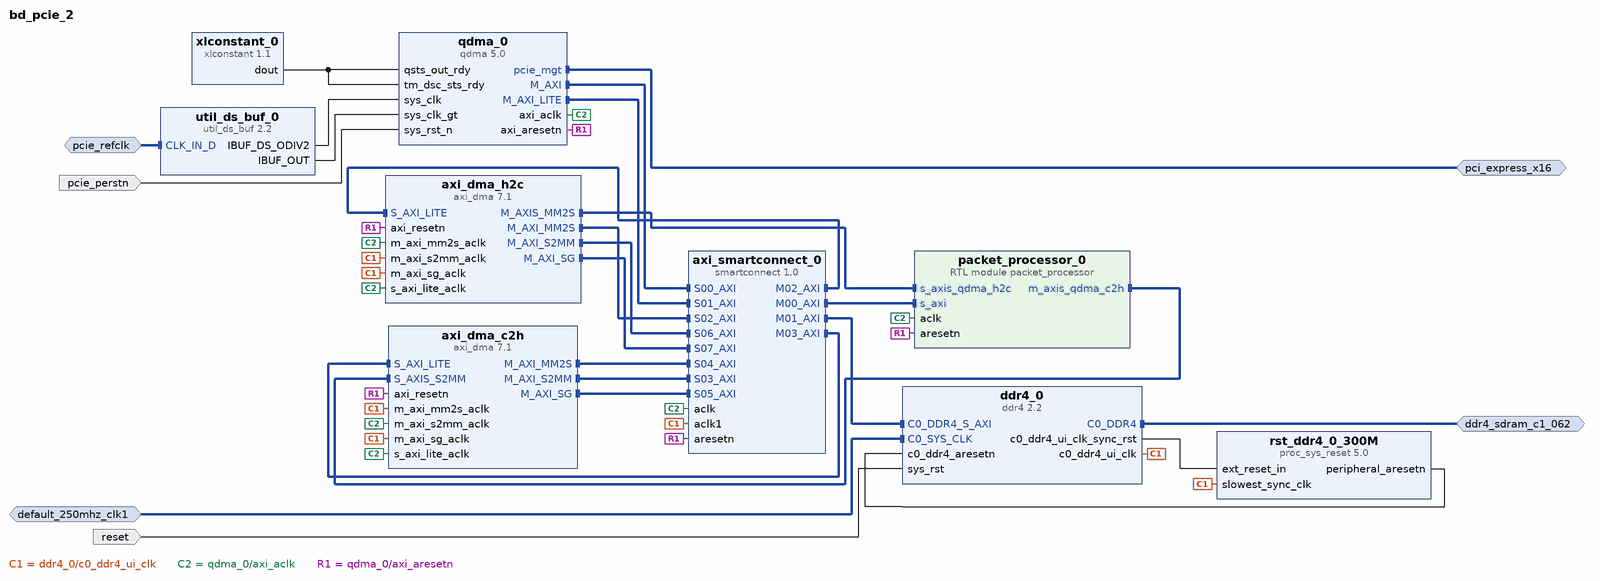
[diagram p0: block diagram of the top level]
# Vivado block design bd_pcie_2, xcvu9p-flga2104-2L-e, Vivado 2023.2
create_bd_design bd_pcie_2

create_bd_intf_port -mode Master -vlnv xilinx.com:interface:pcie_7x_mgt_rtl:1.0 pci_express_x16
create_bd_intf_port -mode Slave -vlnv xilinx.com:interface:diff_clock_rtl:1.0 pcie_refclk
set_property -dict {CONFIG.FREQ_HZ 100000000} [get_bd_intf_ports pcie_refclk]
create_bd_intf_port -mode Master -vlnv xilinx.com:interface:ddr4_rtl:1.0 ddr4_sdram_c1_062
create_bd_intf_port -mode Slave -vlnv xilinx.com:interface:diff_clock_rtl:1.0 default_250mhz_clk1
set_property -dict {CONFIG.FREQ_HZ 250000000} [get_bd_intf_ports default_250mhz_clk1]
create_bd_port -dir I -type rst pcie_perstn
set_property -dict {CONFIG.POLARITY ACTIVE_LOW} [get_bd_ports pcie_perstn]
create_bd_port -dir I -type rst reset
set_property -dict {CONFIG.POLARITY ACTIVE_HIGH} [get_bd_ports reset]

create_bd_cell -type ip -vlnv xilinx.com:ip:qdma:5.0 qdma_0
set_property -dict [list \
  CONFIG.MAILBOX_ENABLE true \
  CONFIG.PCIE_BOARD_INTERFACE pci_express_x16 \
  CONFIG.SYS_RST_N_BOARD_INTERFACE pcie_perstn \
  CONFIG.dma_intf_sel_qdma AXI_MM \
  CONFIG.mode_selection Basic \
  CONFIG.pf0_bar2_enabled_qdma true \
] [get_bd_cells qdma_0]
create_bd_cell -type ip -vlnv xilinx.com:ip:xlconstant:1.1 xlconstant_0
create_bd_cell -type ip -vlnv xilinx.com:ip:util_ds_buf:2.2 util_ds_buf_0
set_property -dict {CONFIG.DIFF_CLK_IN_BOARD_INTERFACE pcie_refclk CONFIG.USE_BOARD_FLOW true} [get_bd_cells util_ds_buf_0]
create_bd_cell -type ip -vlnv xilinx.com:ip:ddr4:2.2 ddr4_0
set_property -dict [list \
  CONFIG.C0_CLOCK_BOARD_INTERFACE default_250mhz_clk1 \
  CONFIG.C0_DDR4_BOARD_INTERFACE ddr4_sdram_c1_062 \
  CONFIG.RESET_BOARD_INTERFACE reset \
] [get_bd_cells ddr4_0]
create_bd_cell -type ip -vlnv xilinx.com:ip:smartconnect:1.0 axi_smartconnect_0
set_property -dict {CONFIG.HAS_ARESETN 1 CONFIG.NUM_CLKS 2 CONFIG.NUM_MI 4 CONFIG.NUM_SI 8} [get_bd_cells axi_smartconnect_0]
create_bd_cell -type ip -vlnv xilinx.com:ip:proc_sys_reset:5.0 rst_ddr4_0_300M
create_bd_cell -type module -reference packet_processor packet_processor_0
create_bd_cell -type ip -vlnv xilinx.com:ip:axi_dma:7.1 axi_dma_h2c
set_property -dict {CONFIG.c_mm2s_burst_size 256} [get_bd_cells axi_dma_h2c]
create_bd_cell -type ip -vlnv xilinx.com:ip:axi_dma:7.1 axi_dma_c2h
set_property -dict {CONFIG.c_mm2s_burst_size 256} [get_bd_cells axi_dma_c2h]

# ---- connections ----

connect_bd_intf_net [get_bd_intf_pins axi_dma_c2h/M_AXI_MM2S] [get_bd_intf_pins axi_smartconnect_0/S04_AXI]
connect_bd_intf_net [get_bd_intf_pins axi_dma_c2h/M_AXI_S2MM] [get_bd_intf_pins axi_smartconnect_0/S03_AXI]
connect_bd_intf_net [get_bd_intf_pins axi_dma_c2h/M_AXI_SG] [get_bd_intf_pins axi_smartconnect_0/S05_AXI]
connect_bd_intf_net [get_bd_intf_pins axi_dma_h2c/M_AXIS_MM2S] [get_bd_intf_pins packet_processor_0/s_axis_qdma_h2c]
connect_bd_intf_net [get_bd_intf_pins axi_dma_h2c/M_AXI_MM2S] [get_bd_intf_pins axi_smartconnect_0/S02_AXI]
connect_bd_intf_net [get_bd_intf_pins axi_dma_h2c/M_AXI_S2MM] [get_bd_intf_pins axi_smartconnect_0/S06_AXI]
connect_bd_intf_net [get_bd_intf_pins axi_dma_h2c/M_AXI_SG] [get_bd_intf_pins axi_smartconnect_0/S07_AXI]
connect_bd_intf_net [get_bd_intf_pins axi_smartconnect_0/M00_AXI] [get_bd_intf_pins packet_processor_0/s_axi]
connect_bd_intf_net [get_bd_intf_pins axi_smartconnect_0/M01_AXI] [get_bd_intf_pins ddr4_0/C0_DDR4_S_AXI]
connect_bd_intf_net [get_bd_intf_pins axi_smartconnect_0/M02_AXI] [get_bd_intf_pins axi_dma_h2c/S_AXI_LITE]
connect_bd_intf_net [get_bd_intf_pins axi_smartconnect_0/M03_AXI] [get_bd_intf_pins axi_dma_c2h/S_AXI_LITE]
connect_bd_intf_net [get_bd_intf_ports ddr4_sdram_c1_062] [get_bd_intf_pins ddr4_0/C0_DDR4]
connect_bd_intf_net -intf_net default_250mhz_clk1_1 [get_bd_intf_ports default_250mhz_clk1] [get_bd_intf_pins ddr4_0/C0_SYS_CLK]
connect_bd_intf_net [get_bd_intf_pins packet_processor_0/m_axis_qdma_c2h] [get_bd_intf_pins axi_dma_c2h/S_AXIS_S2MM]
connect_bd_intf_net [get_bd_intf_ports pcie_refclk] [get_bd_intf_pins util_ds_buf_0/CLK_IN_D]
connect_bd_intf_net [get_bd_intf_pins qdma_0/M_AXI] [get_bd_intf_pins axi_smartconnect_0/S00_AXI]
connect_bd_intf_net [get_bd_intf_pins qdma_0/M_AXI_LITE] [get_bd_intf_pins axi_smartconnect_0/S01_AXI]
connect_bd_intf_net [get_bd_intf_ports pci_express_x16] [get_bd_intf_pins qdma_0/pcie_mgt]
connect_bd_net [get_bd_pins ddr4_0/c0_ddr4_ui_clk] \
  [get_bd_pins axi_smartconnect_0/aclk1] [get_bd_pins rst_ddr4_0_300M/slowest_sync_clk] \
  [get_bd_pins axi_dma_c2h/m_axi_mm2s_aclk] [get_bd_pins axi_dma_c2h/m_axi_sg_aclk] [get_bd_pins axi_dma_h2c/m_axi_s2mm_aclk] \
  [get_bd_pins axi_dma_h2c/m_axi_sg_aclk]
connect_bd_net [get_bd_pins ddr4_0/c0_ddr4_ui_clk_sync_rst] [get_bd_pins rst_ddr4_0_300M/ext_reset_in]
connect_bd_net [get_bd_ports pcie_perstn] [get_bd_pins qdma_0/sys_rst_n]
connect_bd_net [get_bd_pins qdma_0/axi_aclk] \
  [get_bd_pins axi_smartconnect_0/aclk] [get_bd_pins packet_processor_0/aclk] [get_bd_pins axi_dma_c2h/s_axi_lite_aclk] \
  [get_bd_pins axi_dma_h2c/s_axi_lite_aclk] [get_bd_pins axi_dma_h2c/m_axi_mm2s_aclk] \
  [get_bd_pins axi_dma_c2h/m_axi_s2mm_aclk]
connect_bd_net [get_bd_pins qdma_0/axi_aresetn] \
  [get_bd_pins axi_smartconnect_0/aresetn] [get_bd_pins packet_processor_0/aresetn] [get_bd_pins axi_dma_c2h/axi_resetn] \
  [get_bd_pins axi_dma_h2c/axi_resetn]
connect_bd_net [get_bd_ports reset] [get_bd_pins ddr4_0/sys_rst]
connect_bd_net [get_bd_pins rst_ddr4_0_300M/peripheral_aresetn] [get_bd_pins ddr4_0/c0_ddr4_aresetn]
connect_bd_net [get_bd_pins util_ds_buf_0/IBUF_DS_ODIV2] [get_bd_pins qdma_0/sys_clk]
connect_bd_net [get_bd_pins util_ds_buf_0/IBUF_OUT] [get_bd_pins qdma_0/sys_clk_gt]
connect_bd_net [get_bd_pins xlconstant_0/dout] [get_bd_pins qdma_0/tm_dsc_sts_rdy] [get_bd_pins qdma_0/qsts_out_rdy]

# ---- address map ----
assign_bd_address -offset 0x80000000 -range 2G -target_address_space [get_bd_addr_spaces axi_dma_c2h/Data_MM2S] [get_bd_addr_segs ddr4_0/C0_DDR4_MEMORY_MAP/C0_DDR4_ADDRESS_BLOCK]
exclude_bd_addr_seg -offset 0x00000000 -range 4G -target_address_space [get_bd_addr_spaces axi_dma_c2h/Data_MM2S] [get_bd_addr_segs packet_processor_0/s_axi/reg0]
assign_bd_address -offset 0x80000000 -range 2G -target_address_space [get_bd_addr_spaces axi_dma_c2h/Data_S2MM] [get_bd_addr_segs ddr4_0/C0_DDR4_MEMORY_MAP/C0_DDR4_ADDRESS_BLOCK]
exclude_bd_addr_seg -offset 0x00000000 -range 4G -target_address_space [get_bd_addr_spaces axi_dma_c2h/Data_S2MM] [get_bd_addr_segs packet_processor_0/s_axi/reg0]
exclude_bd_addr_seg -offset 0x00000000 -range 4G -target_address_space [get_bd_addr_spaces axi_dma_c2h/Data_SG] [get_bd_addr_segs packet_processor_0/s_axi/reg0]
assign_bd_address -offset 0x80000000 -range 2G -target_address_space [get_bd_addr_spaces axi_dma_h2c/Data_MM2S] [get_bd_addr_segs ddr4_0/C0_DDR4_MEMORY_MAP/C0_DDR4_ADDRESS_BLOCK]
exclude_bd_addr_seg -offset 0x00000000 -range 4G -target_address_space [get_bd_addr_spaces axi_dma_h2c/Data_MM2S] [get_bd_addr_segs packet_processor_0/s_axi/reg0]
exclude_bd_addr_seg -offset 0x00000000 -range 4G -target_address_space [get_bd_addr_spaces axi_dma_h2c/Data_S2MM] [get_bd_addr_segs packet_processor_0/s_axi/reg0]
exclude_bd_addr_seg -offset 0x00000000 -range 4G -target_address_space [get_bd_addr_spaces axi_dma_h2c/Data_SG] [get_bd_addr_segs packet_processor_0/s_axi/reg0]
assign_bd_address -offset 0x0000000080000000 -range 2G -target_address_space [get_bd_addr_spaces qdma_0/M_AXI] [get_bd_addr_segs ddr4_0/C0_DDR4_MEMORY_MAP/C0_DDR4_ADDRESS_BLOCK]
assign_bd_address -offset 0x0000000100000000 -range 4G -target_address_space [get_bd_addr_spaces qdma_0/M_AXI] [get_bd_addr_segs packet_processor_0/s_axi/reg0]
assign_bd_address -offset 0x00000000 -range 2G -target_address_space [get_bd_addr_spaces qdma_0/M_AXI_LITE] [get_bd_addr_segs packet_processor_0/s_axi/reg0]
assign_bd_address -offset 0x80000000 -range 2G -target_address_space [get_bd_addr_spaces qdma_0/M_AXI_LITE] [get_bd_addr_segs ddr4_0/C0_DDR4_MEMORY_MAP/C0_DDR4_ADDRESS_BLOCK]
exclude_bd_addr_seg -offset 0x00000000 -range 1 -target_address_space [get_bd_addr_spaces qdma_0/M_AXI_LITE] [get_bd_addr_segs axi_dma_c2h/S_AXI_LITE/Reg]
exclude_bd_addr_seg -offset 0x00000000 -range 1 -target_address_space [get_bd_addr_spaces qdma_0/M_AXI_LITE] [get_bd_addr_segs axi_dma_h2c/S_AXI_LITE/Reg]

validate_bd_design
save_bd_design
